# EAGLE schematic ESP_esquemático (EAGLE 6.6.0)
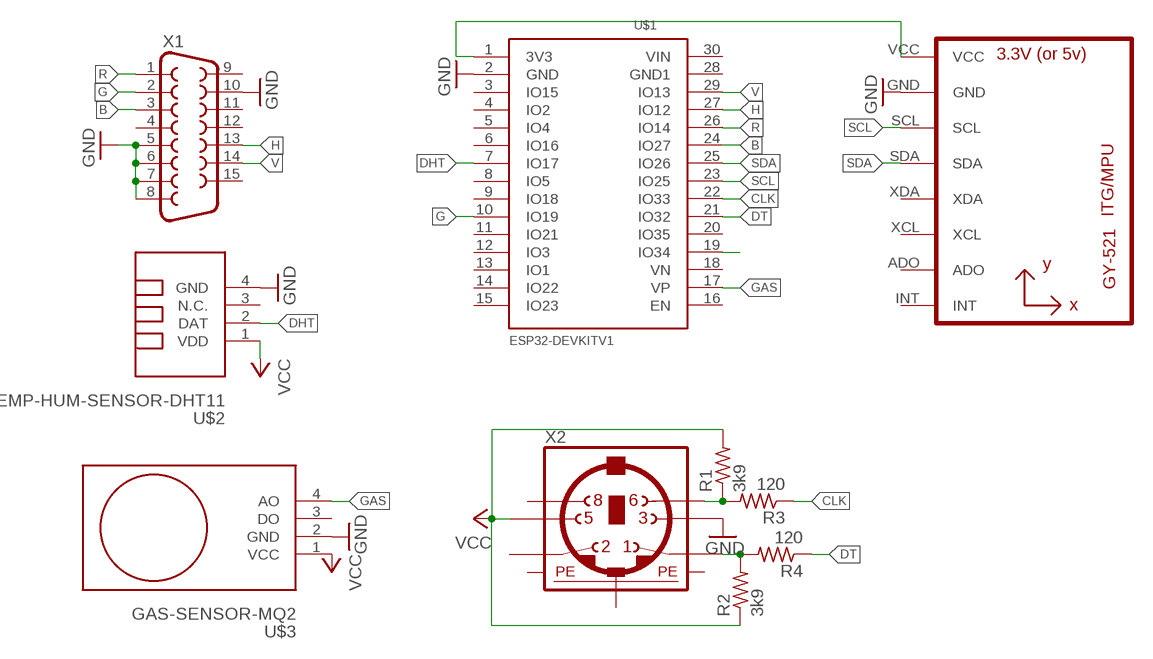
[diagram p0: schematic, sheet 1]

## Parts
R1  3k9  R-US_0204/7  [0204/7]
R2  3k9  R-US_0204/7  [0204/7]
R3  120  R-US_0204/7  [0204/7]
R4  120  R-US_0204/7  [0204/7]
U1  GY-521MPU6050  [GY-521]
U$1  ESP32DEVKITV1  [ESP32-DEVKITV1]
U$2  TEMP-HUM-SENSOR-DHT11  [TEMP-HUM-SENSOR-DHT11]
U$3  GAS-SENSOR-MQ2  [GAS-SENSOR-MQ2]
X1  F15HDH  [HDF15H]
X2  MINI_DIN_6  [M_DIN6]

## Nets
B: U$1.24(IO27) X1.3
CLK: R3.1 U$1.22(IO33)
DHT: U$1.7(IO17) U$2.2(DAT)
DT: R4.1 U$1.21(IO32)
G: U$1.10(IO19) X1.2
GAS: U$1.17(VP) U$3.4(AO)
GND: U1.GND U$1.2(GND) U$2.4(GND) U$3.2(GND) X1.5 X1.6 X1.7 X1.8 X1.10 X2.3
H: U$1.27(IO12) X1.13
N$1: U1.VCC U$1.1(3V3)
N$5: R2.2 R4.2 X2.1
N$8: R1.1 R3.2 X2.6
N$23: U$1.19(IO34)
R: U$1.26(IO14) X1.1
SCL: U1.SCL U$1.23(IO25)
SDA: U1.SDA U$1.25(IO26)
V: U$1.29(IO13) X1.14
VCC: R1.2 R2.1 U$2.1(VDD) U$3.1(VCC) X2.5
Unconnected: U1.ADO U1.INT U1.XCL U1.XDA U$1.3(IO15) U$1.4(IO2) U$1.5(IO4) U$1.6(IO16) U$1.8(IO5) U$1.9(IO18) U$1.11(IO21) U$1.12(IO3) U$1.13(IO1) U$1.14(IO22) U$1.15(IO23) U$1.16(EN) U$1.18(VN) U$1.20(IO35) U$1.28(GND1) U$1.30(VIN) U$2.3(N.C.) U$3.3(DO) X1.4 X1.9 X1.11 X1.12 X1.15 X2.2 X2.8

## Power pins joined to a net without a drawn wire
PE1: X2.SH1(PE1)
PE2: X2.SH2(PE2)
PE3: X2.SH3(PE3)

## Library data of the parts
R1-R4 = rcl:R-US_: RESISTOR, American symbol
U1 = gy-521:GY-521
U$1 = ESP32-DEVKITV1:ESP32DEVKITV1
U$2 = diy-modules:TEMP-HUM-SENSOR-DHT11: DHT11 - digital humidity & temperature sensor DHT11 datasheet available here: https://akizukidenshi.com/download/ds/aosong/DHT11.pdf Click here to find device on ebay.com <http://www.ebay.com/sch/dht11+digital+sensor>
U$3 = diy-modules:GAS-SENSOR-MQ2: Gas Sensor based on MQ-2 device Guide describing how to use MQ-2 sensor with Arduino is available here: http://www.instructables.com/id/How-to-use-MQ2-Gas-Sensor-Arduino-Tutorial/ MQ-2 sensor datasheet is available here: http://gas-sensor.ru/pdf/combustible-gas-sensor.pdf Click here to find device on ebay.com <http://www.ebay.com/sch/mq2+sensor+module+smoke>
X1 = adafruit:F15: SUB-D HDH is also known as a 'right angle VGA' connector
X2 = mini_din:MINI_DIN_6